# EAGLE design Newtech Music Board (EAGLE 6.6.0)

## Sheet 1 of 3
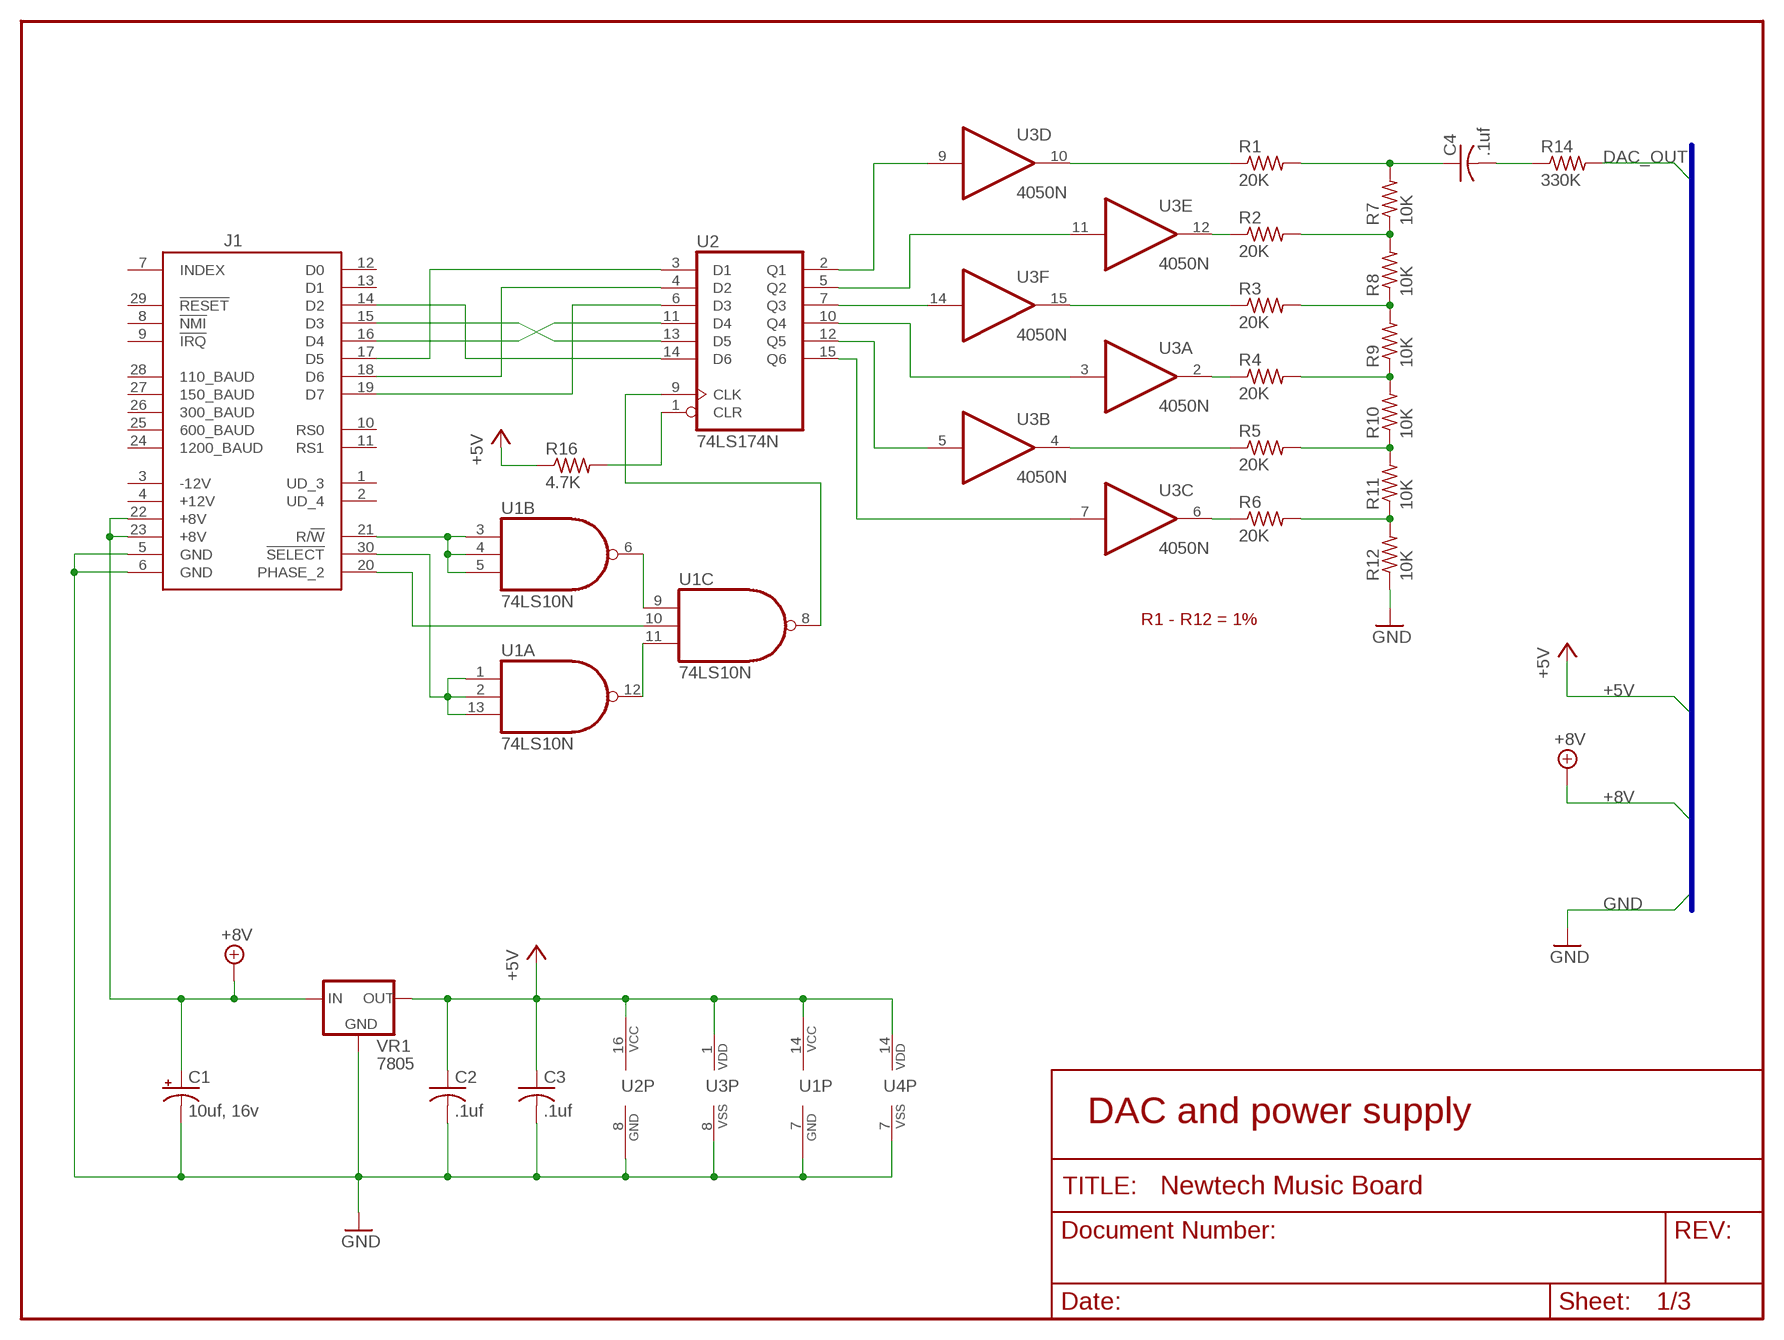
[diagram p0: schematic, sheet 1]

### Parts
C1  10uf, 16v  CPOL-USE2.5-6  [E2,5-6]
C2  .1uf  C-US025-025X050  [C025-025X050]
C3  .1uf  C-US025-025X050  [C025-025X050]
C4  .1uf  C-US025-024X044  [C025-024X044]
J1  SS-30_BOARD_CONNECTOR  [SS-30_BOARD_CONNECTOR]
R1  20K  R-US_0204/7  [0204/7]
R2  20K  R-US_0204/7  [0204/7]
R3  20K  R-US_0204/7  [0204/7]
R4  20K  R-US_0204/7  [0204/7]
R5  20K  R-US_0204/7  [0204/7]
R6  20K  R-US_0204/7  [0204/7]
R7  10K  R-US_0204/7  [0204/7]
R8  10K  R-US_0204/7  [0204/7]
R9  10K  R-US_0204/7  [0204/7]
R10  10K  R-US_0204/7  [0204/7]
R11  10K  R-US_0204/7  [0204/7]
R12  10K  R-US_0204/7  [0204/7]
R14  330K  R-US_0204/7  [0204/7]
R16  4.7K  R-US_0204/7  [0204/7]
U1  74LS10N  [DIL14]
U2  74LS174N  [DIL16]
U3  4050N  [DIL16]
U4  4069N  [DIL14]
VR1  7805  78XXL  [78XXL]

### Nets
!SELECT: J1.30(!SELECT) U1.1(A:I0) U1.2(A:I1) U1.13(A:I2)
+5V: C2.1 C3.1 R16.1 U1.14(P:VCC) U2.16(VCC) U3.1(P:VDD) U4.14(P:VDD) VR1.OUT ; also sheet 3
+8V: C1.+ J1.22(+8V) J1.23(+8V) VR1.IN ; also sheet 3
DAC_OUT: R14.2 ; also sheet 2
GND: C1.- C2.2 C3.2 J1.5(GND) J1.6(GND) R12.1 U1.7(P:GND) U2.8(GND) U3.8(P:VSS) U4.7(P:VSS) VR1.GND ; also sheet 3
N$1: J1.19(D7) U2.6(D3)
N$2: J1.18(D6) U2.4(D2)
N$3: J1.17(D5) U2.3(D1)
N$4: U1.6(B:O) U1.9(C:I0)
N$5: U1.11(C:I2) U1.12(A:O)
N$6: J1.16(D4) U2.11(D4)
N$7: J1.15(D3) U2.13(D5)
N$8: J1.14(D2) U2.14(D6)
N$9: U2.2(Q1) U3.9(D:I)
N$10: U2.5(Q2) U3.11(E:I)
N$11: U2.7(Q3) U3.14(F:I)
N$12: U2.10(Q4) U3.3(A:I)
N$13: U2.12(Q5) U3.5(B:I)
N$14: U2.15(Q6) U3.7(C:I)
N$16: U1.8(C:O) U2.9(CLK)
N$17: R16.2 U2.1(CLR)
N$18: R1.1 U3.10(D:O)
N$19: R2.1 U3.12(E:O)
N$20: R3.1 U3.15(F:O)
N$21: R4.1 U3.2(A:O)
N$22: R5.1 U3.4(B:O)
N$23: R6.1 U3.6(C:O)
N$24: R2.2 R7.1 R8.2
N$25: R3.2 R8.1 R9.2
N$26: R4.2 R9.1 R10.2
N$27: R5.2 R10.1 R11.2
N$28: R6.2 R11.1 R12.2
N$29: C4.1 R1.2 R7.2
N$30: C4.2 R14.1
PHASE2: J1.20(PHASE_2) U1.10(C:I1)
R/!W: J1.21(R/!W) U1.3(B:I0) U1.4(B:I1) U1.5(B:I2)
Unconnected: J1.1(UD_3) J1.2(UD_4) J1.7(INDEX) J1.8(!NMI) J1.9(!IRQ) J1.10(RS0) J1.11(RS1) J1.12(D0) J1.13(D1) J1.24(1200_BAUD) J1.25(600_BAUD) J1.26(300_BAUD) J1.27(150_BAUD) J1.28(110_BAUD) J1.29(!RESET)

### Buses
+5V,+8V,GND,DAC_OUT,LPF_OUT

### Notes on the sheet
- R1 - R12 = 1%
- DAC and power supply

## Sheet 2 of 3
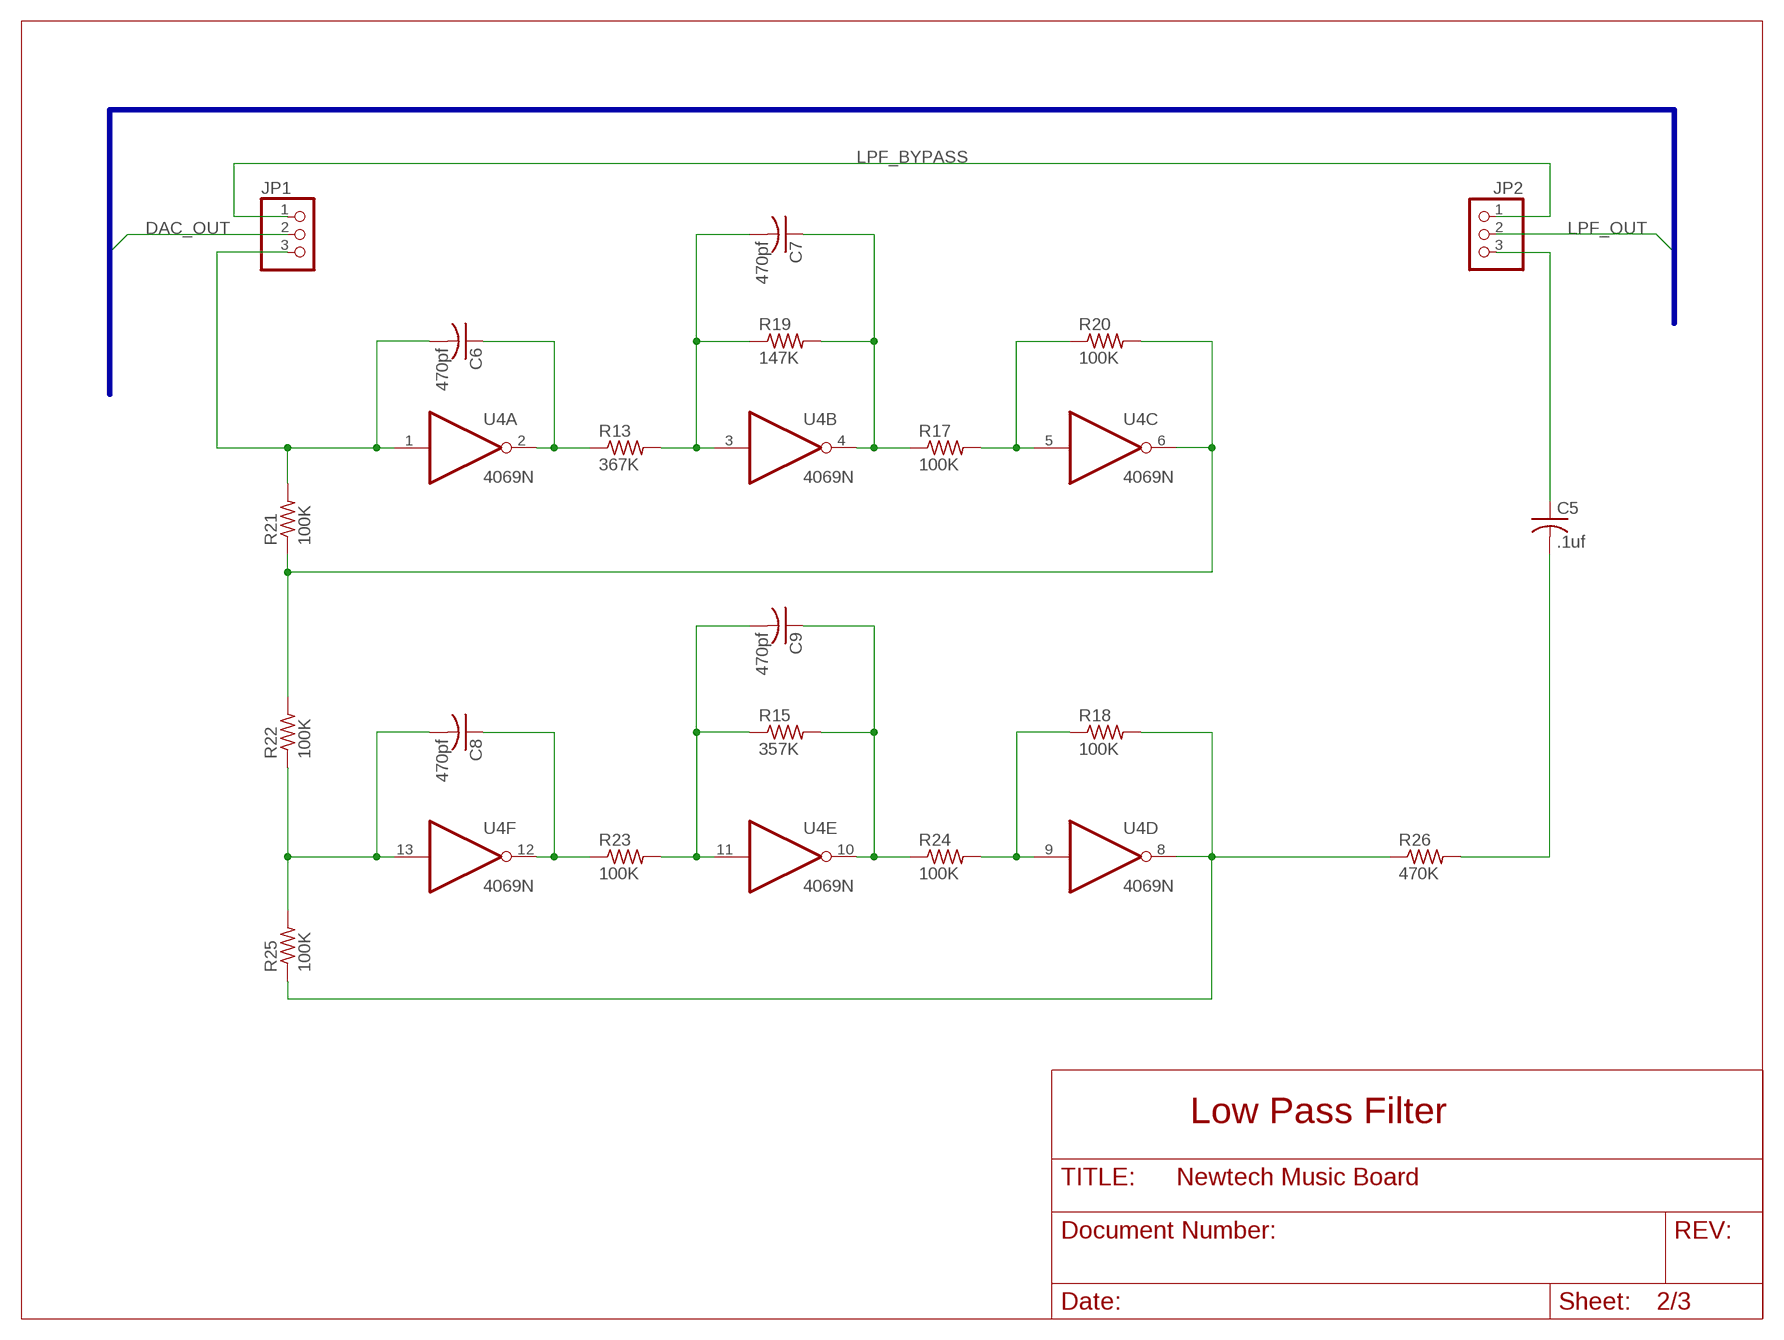
[diagram p1: schematic, sheet 2]

### Parts
C5  .1uf  C-US025-025X050  [C025-025X050]
C6  470pf  C-US050-045X075  [C050-045X075]
C7  470pf  C-US050-045X075  [C050-045X075]
C8  470pf  C-US050-045X075  [C050-045X075]
C9  470pf  C-US050-045X075  [C050-045X075]
JP1  PINHD-1X3  [1X03]
JP2  PINHD-1X3  [1X03]
R13  367K  R-US_0204/7  [0204/7]
R15  357K  R-US_0204/7  [0204/7]
R17  100K  R-US_0204/7  [0204/7]
R18  100K  R-US_0204/7  [0204/7]
R19  147K  R-US_0204/7  [0204/7]
R20  100K  R-US_0204/7  [0204/7]
R21  100K  R-US_0204/7  [0204/7]
R22  100K  R-US_0204/7  [0204/7]
R23  100K  R-US_0204/7  [0204/7]
R24  100K  R-US_0204/7  [0204/7]
R25  100K  R-US_0204/7  [0204/7]
R26  470K  R-US_0204/7  [0204/7]

### Nets
DAC_OUT: JP1.2 ; also sheet 1
LPF_BYPASS: JP1.1 JP2.1
LPF_OUT: JP2.2 ; also sheet 3
N$31: C6.2 JP1.3 R21.2 U4.1(A:I)
N$32: C5.1 JP2.3
N$33: C6.1 R13.1 U4.2(A:O)
N$34: C7.2 R13.2 R19.1 U4.3(B:I)
N$35: C7.1 R17.1 R19.2 U4.4(B:O)
N$37: R17.2 R20.1 U4.5(C:I)
N$38: R20.2 R21.1 R22.2 U4.6(C:O)
N$40: C8.1 R23.1 U4.12(F:O)
N$41: C9.2 R15.1 R23.2 U4.11(E:I)
N$42: C9.1 R15.2 R24.1 U4.10(E:O)
N$43: R18.1 R24.2 U4.9(D:I)
N$45: R18.2 R25.1 R26.1 U4.8(D:O)
N$49: C5.2 R26.2
N$56: C8.2 R22.1 R25.2 U4.13(F:I)

### Buses
+5V,+8V,GND,DAC_OUT,LPF_OUT

### Notes on the sheet
- Low Pass Filter

## Sheet 3 of 3
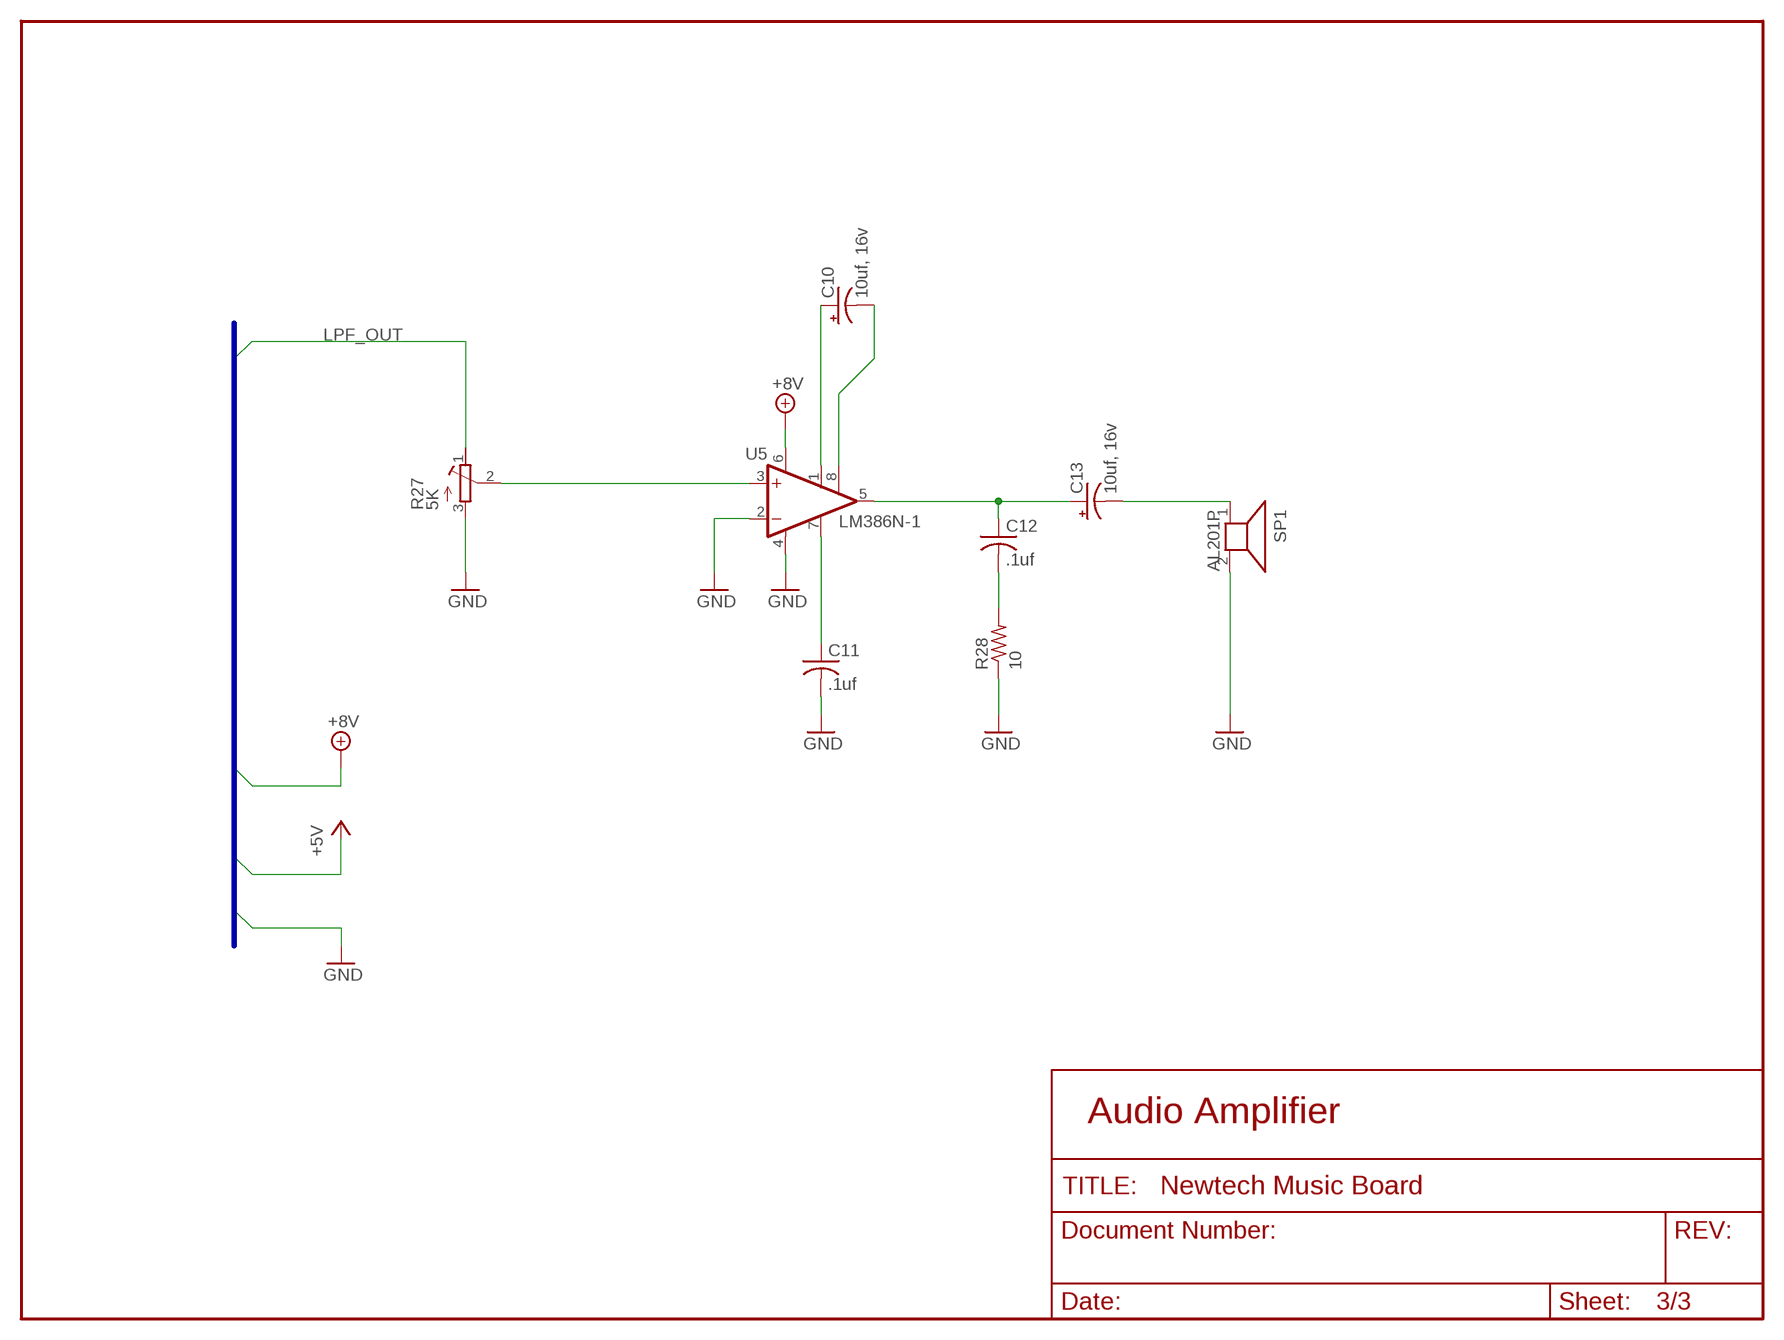
[diagram p2: schematic, sheet 3]

### Parts
C10  10uf, 16v  CPOL-USE2.5-6  [E2,5-6]
C11  .1uf  C-US025-025X050  [C025-025X050]
C12  .1uf  C-US025-025X050  [C025-025X050]
C13  10uf, 16v  CPOL-USE2.5-6  [E2,5-6]
R27  5K  R-TRIMM43P  [RTRIM43P]
R28  10  R-US_0204/7  [0204/7]
SP1  AL201P  [AL201P]
U5  LM386N-1  [DIL08]

### Nets
+8V: U5.6(VS) ; also sheet 1
GND: C11.2 R27.3(E) R28.1 SP1.2 U5.2(-IN) U5.4(GND) ; also sheet 1
LPF_OUT: R27.1(A) ; also sheet 2
N$36: C10.+ U5.1(GAIN)
N$39: R27.2(S) U5.3(+IN)
N$44: C11.1 U5.7(BYPASS)
N$46: C10.- U5.8(GAIN)
N$47: C12.1 C13.+ U5.5(OUT)
N$48: C13.- SP1.1
N$50: C12.2 R28.2

### Buses
+5V,+8V,GND,DAC_OUT,LPF_OUT

### Notes on the sheet
- Audio Amplifier

## Power pins joined to a net without a drawn wire
+12V: J1.4(+12V)
-12V: J1.3(-12V)

## Library data of the parts
C1 C10 C13 = rcl:CPOL-US: POLARIZED CAPACITOR, American symbol
C2-C9 C11 C12 = rcl:C-US: CAPACITOR, American symbol
J1 = Bob:SS-30_BOARD_CONNECTOR
JP1 JP2 = pinhead:PINHD-1X3: PIN HEADER
R1-R26 R28 = rcl:R-US_: RESISTOR, American symbol
R27 = resistor:R-TRIMM: Trimm resistor
SP1 = buzzer:AL201P: SPEAKER Source: Buerklin; OC_FARNELL: unknown; OC_NEWARK: unknown
U1 = 74xx-us:74*10: Triple 3-input NAND gate
U2 = 74xx-us:74*174: Hex D type FLIP FLOP, clear
U3 = 40xx:4050: Hex non-inverting BUFFER
U4 = 40xx:4069: Hex INVERTER
U5 = linear:LM386?-*: Low Voltage Audio Power Amplifier Source: http://cache.national.com/ds/LM/LM386.pdf
VR1 = v-reg:78XXL: VOLTAGE REGULATOR

## Board
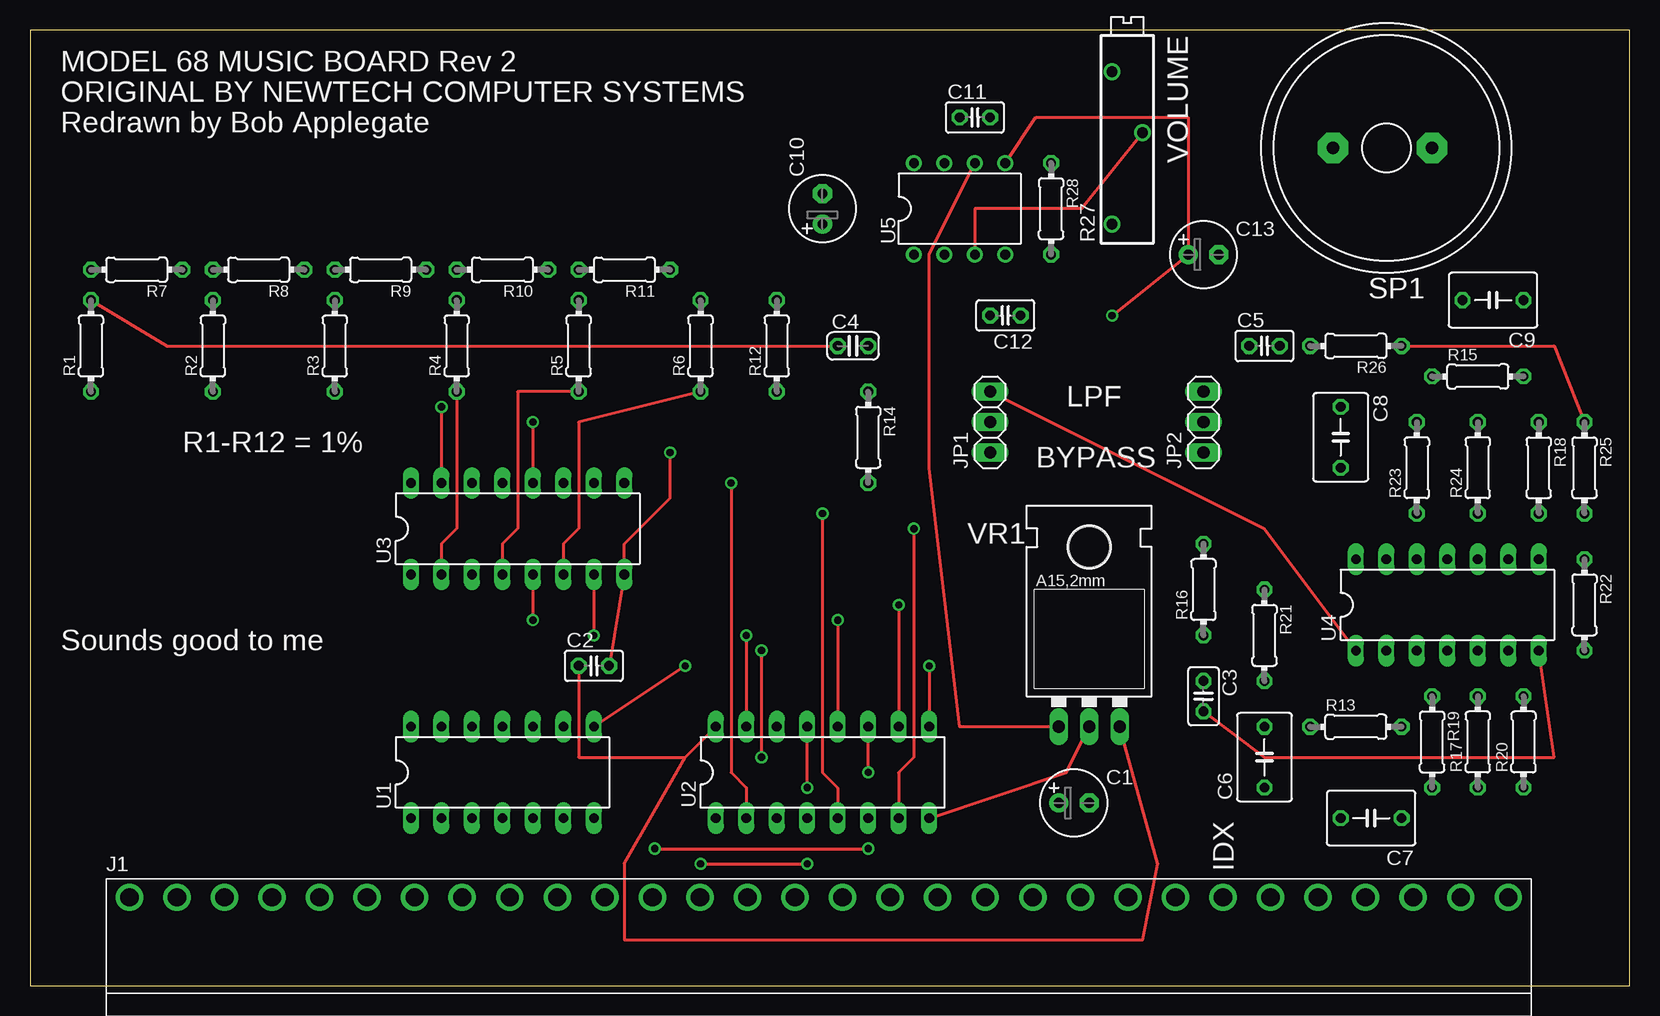
[diagram p3: board, top side]
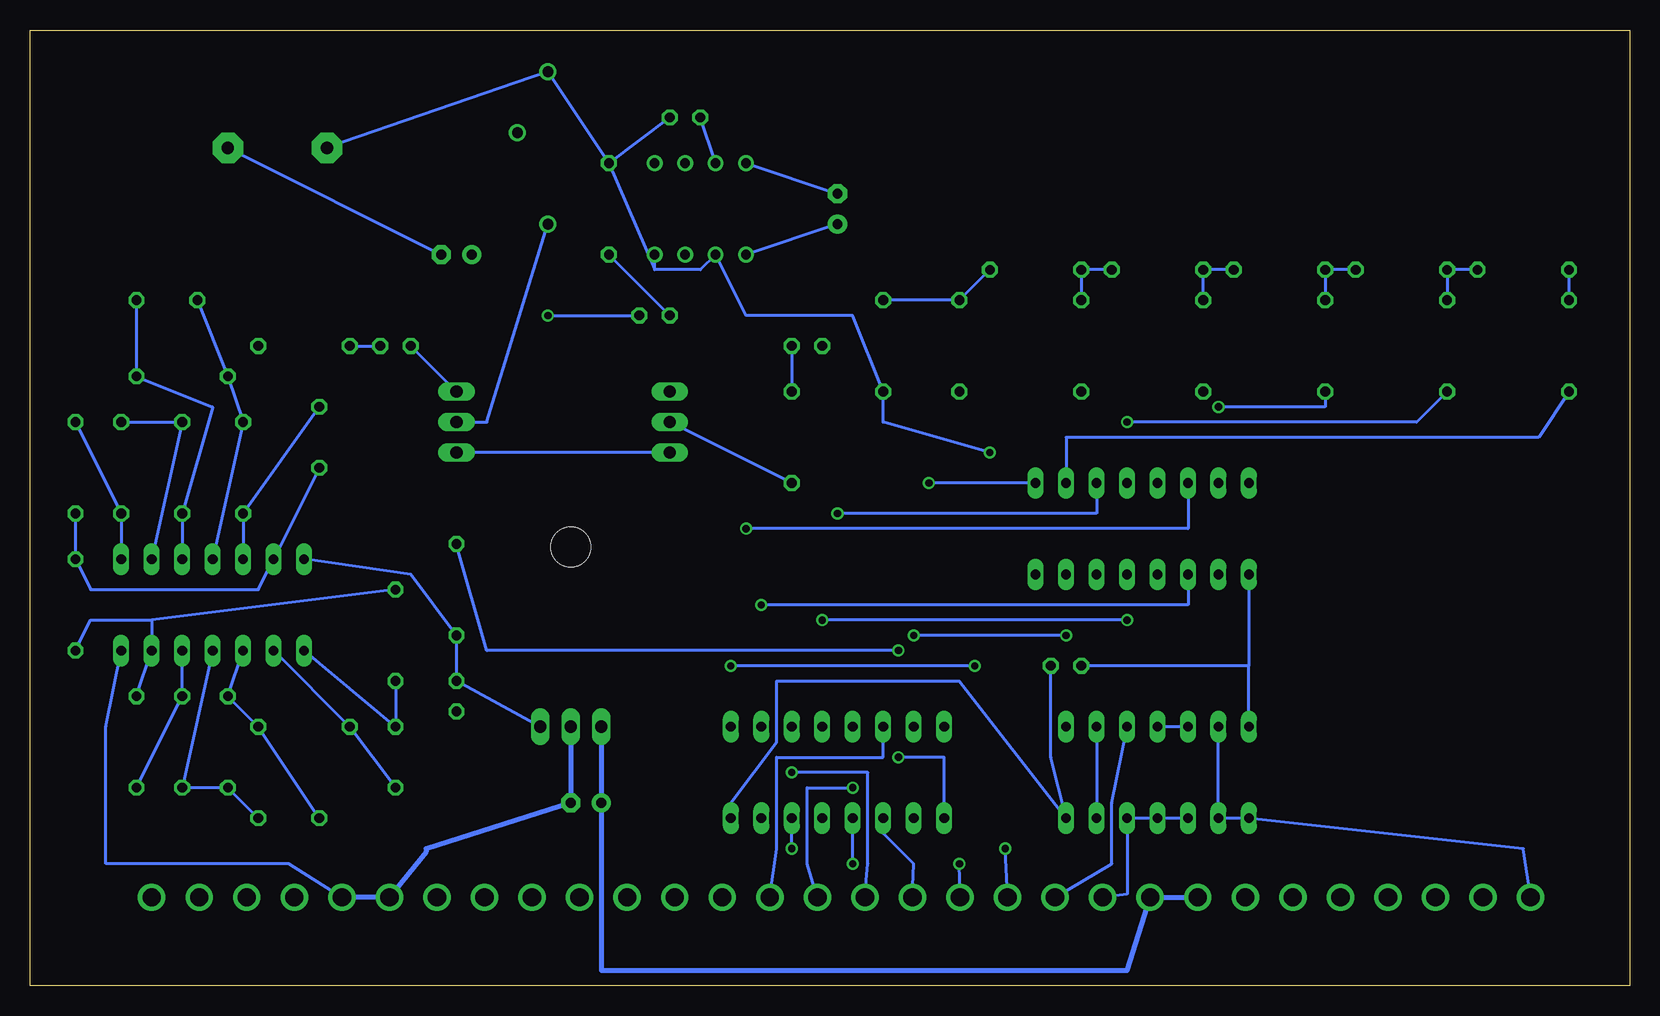
[diagram p4: board, bottom side, seen from below]

Size 133.33 x 79.68 mm. Coordinates in mm from the lower left corner, seen from the top.
Outline: 0,0 133.33,0 133.33,79.68 0,79.68 0,0
Copper layers (1*16): Top 0.035mm / dielectric 1.5mm / Bottom 0.035mm
Design rules "default": minimum track width 10mil, minimum drill 24mil, track to track 8mil, track to pad 8mil, pad to pad 8mil, via to via 8mil, smd to smd 8mil, copper to edge 40mil, drill to drill 8mil, minimum pad ring 10mil, minimum via ring 8mil, stop-mask expansion 4mil, vias tented up to drill 0mil, thermal gap 10mil

### Footprints (pad centres in the part's own frame; a part is rotated, then mirrored left to right if it is on the bottom)
E2,5-6 = drill 0.813 pad 1.6: + -1.27,0 | drill 0.813 pad 1.6 octagon: - 1.27,0
C025-025X050 = drill 0.813 octagon: 1 -1.27,0; 2 1.27,0
C025-024X044 = drill 0.813 octagon: 1 -1.27,0; 2 1.27,0
C050-045X075 = drill 0.813 octagon: 1 -2.54,0; 2 2.54,0
SS-30_BOARD_CONNECTOR = drill 1.524: 1 57.15,3.556; 2 53.188,3.556; 3 49.225,3.556; 4 45.263,3.556; 5 41.3,3.556; 6 37.338,3.556; 7 33.376,3.556; 8 29.413,3.556; 9 25.451,3.556; 10 21.488,3.556; 11 17.526,3.556; 12 13.564,3.556; 13 9.601,3.556; 14 5.639,3.556; 15 1.676,3.556; 16 -2.286,3.556; 17 -6.248,3.556; 18 -10.211,3.556; 19 -14.173,3.556; 20 -18.136,3.556; 21 -22.098,3.556; 22 -26.06,3.556; 23 -30.023,3.556; 24 -33.985,3.556; 25 -37.948,3.556; 26 -41.91,3.556; 27 -45.872,3.556; 28 -49.835,3.556; 29 -53.797,3.556; 30 -57.76,3.556
1X03 = drill 1.016 long: 1 -2.54,0; 2 0,0; 3 2.54,0
0204/7 = drill 0.813 octagon: 1 -3.81,0; 2 3.81,0
RTRIM43P = drill 0.9: 1 -7.62,1.27; 2 0,-1.27; 3 5.08,1.27
AL201P = drill 1.016 pad 2.54 octagon: 1 -3.81,0; 2 4.445,0
DIL14 = drill 0.813 long: 1 -7.62,-3.81; 2 -5.08,-3.81; 3 -2.54,-3.81; 4 0,-3.81; 5 2.54,-3.81; 6 5.08,-3.81; 7 7.62,-3.81; 8 7.62,3.81; 9 5.08,3.81; 10 2.54,3.81; 11 0,3.81; 12 -2.54,3.81; 13 -5.08,3.81; 14 -7.62,3.81
DIL16 = drill 0.813 long: 1 -8.89,-3.81; 2 -6.35,-3.81; 3 -3.81,-3.81; 4 -1.27,-3.81; 5 1.27,-3.81; 6 3.81,-3.81; 7 6.35,-3.81; 8 8.89,-3.81; 9 8.89,3.81; 10 6.35,3.81; 11 3.81,3.81; 12 1.27,3.81; 13 -1.27,3.81; 14 -3.81,3.81; 15 -6.35,3.81; 16 -8.89,3.81
DIL08 = drill 0.813 pad 1.27: 1 -3.81,-3.81; 2 -1.27,-3.81; 3 1.27,-3.81; 4 3.81,-3.81; 5 3.81,3.81; 6 1.27,3.81; 7 -1.27,3.81; 8 -3.81,3.81
78XXL = drill 1.016 long: GND 0,-3.81; IN -2.54,-3.81; OUT 2.54,-3.81 | hole 3.302: 0,11.176

### Placement (x,y rotation side)
C1  87,15.24 0 top
C2  46.99,26.67 0 top
C3  97.79,24.13 270 top
C4  68.58,53.34 0 top
C5  102.87,53.34 0 top
C6  102.87,19.05 90 top
C7  111.76,13.97 180 top
C8  109.22,45.72 270 top
C9  121.92,57.15 180 top
C10  66.04,64.77 90 top
C11  78.74,72.39 0 top
C12  81.28,55.88 180 top
C13  97.79,60.96 0 top
J1  66.04,3.81 0 top
JP1  80.01,46.99 90 top
JP2  97.79,46.99 90 top
R1  5.08,53.34 90 top
R2  15.24,53.34 90 top
R3  25.4,53.34 90 top
R4  35.56,53.34 90 top
R5  45.72,53.34 90 top
R6  55.88,53.34 90 top
R7  8.89,59.69 180 top
R8  19.05,59.69 180 top
R9  29.21,59.69 180 top
R10  39.37,59.69 180 top
R11  49.53,59.69 180 top
R12  62.23,53.34 90 top
R13  110.49,21.59 0 top
R14  69.85,45.72 270 top
R15  120.65,50.8 0 top
R16  97.79,33.02 90 top
R17  120.65,20.32 90 top
R18  125.73,43.18 270 top
R19  116.84,20.32 270 top
R20  124.46,20.32 90 top
R21  102.87,29.21 270 top
R22  129.54,31.75 270 top
R23  115.57,43.18 90 top
R24  120.65,43.18 90 top
R25  129.54,43.18 270 top
R26  110.49,53.34 180 top
R27  91.44,71.12 90 top
R28  85.09,64.77 270 top
SP1  113.03,69.85 180 top
U1  39.37,17.78 0 top
U2  66.04,17.78 0 top
U3  40.64,38.1 0 top
U4  118.11,31.75 0 top
U5  77.47,64.77 0 top
VR1  88.27,25.4 0 top

### Tracks (layer width: path | path; a pad name or v marks a point on that pad's centre or on a via)
!SELECT
  Bottom 0.254: J1.30 8.89,11.43 U1.1 U1.2 U1.13
+5V
  Top 0.254: C2.1 45.72,19.05 54.61,19.05 | 54.61,19.05 U2.16 | VR1.OUT 93.98,10.16 92.71,3.81 49.53,3.81 49.53,10.16 54.61,19.05
  Bottom 0.254: U1.14 31.75,26.67 | 31.75,26.67 C2.1 | U3.1 31.75,26.67 | VR1.OUT C3.1 R16.1 101.6,34.29 U4.14
+8V
  Top 0.254: VR1.IN 77.47,21.59 74.93,43.18 74.93,60.96 U5.6
  Bottom 0.406: VR1.IN C1.+ 85.72,1.27 41.91,1.27 J1.22 J1.23
DAC_OUT
  Bottom 0.254: R14.2 JP1.2
GND  (via drill 0.6)
  Top 0.254: C2.2 U3.8 49.53,36.83 53.34,40.64 v53.34,44.45 | C3.2 102.87,19.05 127,19.05 U4.7 | U2.8 86.36,17.78 VR1.GND
  Bottom 0.254: C11.2 R28.1 | 81.28,59.69 77.47,59.69 U5.2 73.66,55.88 64.77,55.88 R12.1 62.23,46.99 v53.34,44.45 | 81.28,59.69 U5.4 | R28.1 81.28,59.69 | R28.1 R27.3 SP1.2 | J1.5 111.76,10.16 127,10.16 127,21.59 U4.7 | C2.2 48.26,19.05 U1.7 55.88,25.4 71.12,25.4 71.12,20.32 74.93,15.24 U2.8
  Bottom 0.406: VR1.GND C1.- 100.33,11.43 100.33,11.18 J1.6 J1.5
LPF_BYPASS
  Bottom 0.254: JP1.1 JP2.1
LPF_OUT
  Bottom 0.254: JP2.2 95.25,46.99 R27.1
N$1  (via drill 0.6)
  Top 0.254: v52.07,11.43 v69.85,11.43
  Bottom 0.254: J1.19 v52.07,11.43 | v69.85,11.43 U2.6
N$2  (via drill 0.6)
  Top 0.254: v55.88,10.16 v64.77,10.16
  Bottom 0.254: J1.18 v55.88,10.16 | v64.77,10.16 U2.4
N$3
  Bottom 0.254: J1.17 59.69,10.16 62.23,12.7 U2.3
N$4
  Bottom 0.254: U1.9 U1.6
N$5
  Bottom 0.254: U1.12 U1.11
N$6  (via drill 0.6)
  Top 0.254: v69.85,17.78 U2.11
  Bottom 0.254: J1.16 63.5,10.16 63.5,17.78 v69.85,17.78
N$7  (via drill 0.6)
  Top 0.254: v64.77,16.51 U2.13
  Bottom 0.254: J1.15 68.58,10.16 68.58,16.51 v64.77,16.51
N$8
  Bottom 0.254: J1.14 71.12,11.43 71.12,19.05 62.23,19.05 U2.14
N$9  (via drill 0.6)
  Top 0.254: v58.42,41.91 58.42,17.78 59.69,16.51 U2.2
  Bottom 0.254: U3.9 v58.42,41.91
N$10  (via drill 0.6)
  Top 0.254: v66.04,39.37 66.04,17.78 67.31,16.51 U2.5
  Bottom 0.254: U3.11 44.45,39.37 v66.04,39.37
N$11  (via drill 0.6)
  Top 0.254: v73.66,38.1 73.66,19.05 72.39,17.78 U2.7
  Bottom 0.254: U3.14 36.83,38.1 v73.66,38.1
N$12  (via drill 0.6)
  Top 0.254: v72.39,31.75 U2.10
  Bottom 0.254: U3.3 36.83,31.75 v72.39,31.75
N$13  (via drill 0.6)
  Top 0.254: U3.5 v41.91,30.48 | v67.31,30.48 U2.12
  Bottom 0.254: v41.91,30.48 v67.31,30.48
N$14  (via drill 0.6)
  Top 0.254: U3.7 v46.99,29.21 | v59.69,29.21 U2.15
  Bottom 0.254: v46.99,29.21 v59.69,29.21
N$16  (via drill 0.6)
  Top 0.254: U1.8 v54.61,26.67 | v74.93,26.67 U2.9
  Bottom 0.254: v54.61,26.67 v74.93,26.67
N$17  (via drill 0.6)
  Top 0.254: v60.96,19.05 v60.96,27.94
  Bottom 0.254: U2.1 57.15,19.05 v60.96,19.05 | v60.96,27.94 95.25,27.94 R16.2
N$18
  Bottom 0.254: R1.1 7.62,45.72 46.99,45.72 U3.10
N$19  (via drill 0.6)
  Top 0.254: v41.91,46.99 U3.12
  Bottom 0.254: R2.1 17.78,46.99 v41.91,46.99
N$20  (via drill 0.6)
  Top 0.254: v34.29,48.26 U3.15
  Bottom 0.254: R3.1 25.4,48.26 v34.29,48.26
N$21
  Top 0.254: R4.1 35.56,38.1 34.29,36.83 U3.2
N$22
  Top 0.254: R5.1 40.64,49.53 40.64,38.1 39.37,36.83 U3.4
N$23
  Top 0.254: R6.1 45.72,46.99 45.72,38.1 44.45,36.83 U3.6
N$24
  Bottom 0.254: R7.1 R8.2 R2.2
N$25
  Bottom 0.254: R8.1 R9.2 R3.2
N$26
  Bottom 0.254: R9.1 R10.2 R4.2
N$27
  Bottom 0.254: R10.1 R11.2 R5.2
N$28
  Bottom 0.254: R11.1 R6.2 R12.2
N$29
  Top 0.254: R1.2 11.43,53.34 C4.1
  Bottom 0.254: R1.2 R7.2
N$30
  Bottom 0.254: C4.2 R14.1
N$31
  Top 0.254: JP1.3 102.87,38.1 U4.1
  Bottom 0.254: U4.1 C6.2 R21.2
N$32
  Bottom 0.254: C5.1 JP2.3
N$33
  Bottom 0.254: U4.2 R13.1 C6.1
N$34
  Bottom 0.254: U4.3 R19.1 R13.2 C7.2
N$35
  Bottom 0.254: U4.4 R17.1 R19.2 C7.1
N$36
  Bottom 0.254: C10.+ U5.1
N$37
  Bottom 0.254: U4.5 R17.2 R20.1
N$38
  Bottom 0.254: R22.2 128.27,30.48 123.19,30.48 | 123.19,30.48 U4.6 R20.2 | R21.1 123.19,30.48
N$39
  Top 0.254: R27.2 87.63,64.77 78.74,64.77 U5.3
N$40
  Bottom 0.254: U4.12 R23.1 C8.1
N$41
  Bottom 0.254: U4.11 R23.2 R15.1 C9.2
N$42
  Bottom 0.254: U4.10 R24.1 118.11,48.26 R15.2 C9.1
N$43
  Bottom 0.254: U4.9 R24.2 R18.1
N$44
  Bottom 0.254: U5.7 C11.1
N$45
  Top 0.254: R26.1 127,53.34 R25.1
  Bottom 0.254: U4.8 R18.2 R25.1
N$46
  Bottom 0.254: U5.8 C10.-
N$47  (via drill 0.6)
  Top 0.254: v90.17,55.88 C13.+ 96.52,72.39 83.82,72.39 U5.5
  Bottom 0.254: v90.17,55.88 C12.1
N$48
  Bottom 0.254: SP1.1 C13.-
N$49
  Bottom 0.254: R26.2 C5.2
N$50
  Bottom 0.254: C12.2 R28.2
N$56
  Bottom 0.254: C8.2 U4.13 114.3,33.02 128.27,33.02 R22.1 R25.2
PHASE2
  Bottom 0.254: J1.20 43.18,10.16 43.18,15.24 U1.10
R/!W
  Bottom 0.254: U1.3 U1.4 U1.5 41.91,7.62 J1.21

### Text on the board
tNames: MODEL 68 MUSIC BOARD Rev 2 | ORIGINAL BY NEWTECH COMPUTER SYSTEMS | Redrawn by Bob Applegate | VOLUME | LPF | R1-R12 = 1% | BYPASS | Sounds good to me | IDX